# EAGLE design Stick1_jr1 (EAGLE 7.6.0)
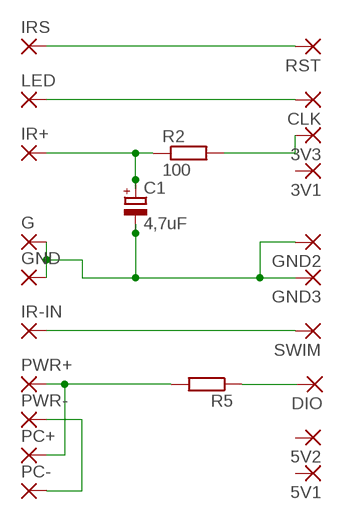
[diagram p0: schematic, sheet 1]

## Parts
3V1  SMD2  [SMD1,27-2,54]
3V3  SMD2  [SMD1,27-2,54]
5V1  SMD2  [SMD1,27-2,54]
5V2  SMD2  [SMD1,27-2,54]
C1  4,7uF  CPOL-EUE1.8-4  [E1,8-4]
CLK  SMD2  [SMD1,27-2,54]
DIO  SMD2  [SMD1,27-2,54]
G  SMD2  [SMD1,27-2,54]
GND  SMD2  [SMD1,27-2,54]
GND2  SMD2  [SMD1,27-2,54]
GND3  SMD2  [SMD1,27-2,54]
IR+  SMD2  [SMD1,27-2,54]
IR-IN  SMD2  [SMD1,27-2,54]
IRS  SMD2  [SMD1,27-2,54]
LED  SMD2  [SMD1,27-2,54]
PC+  SMD2  [SMD1,27-2,54]
PC-  SMD2  [SMD1,27-2,54]
PWR+  SMD2  [SMD1,27-2,54]
PWR-  SMD2  [SMD1,27-2,54]
R2  100  R-EU_0204/7  [0204/7]
R5  R-EU_0204/7  [0204/7]
RST  SMD2  [SMD1,27-2,54]
SWIM  SMD2  [SMD1,27-2,54]

## Nets
N$2 [Power]: 3V3.1(P) R2.2
N$3 [Power]: C1.+ IR+.1(P) R2.1
N$4: PC-.1(P) PWR-.1(P)
N$5: PC+.1(P) PWR+.1(P) R5.2
N$6: DIO.1(P) R5.1
N$7: CLK.1(P) LED.1(P)
N$8: IRS.1(P) RST.1(P)
N$9: IR-IN.1(P) SWIM.1(P)
N$11 [Power]: C1.- G.1(P) GND2.1(P) GND3.1(P) GND.1(P)
Unconnected: 3V1.1(P) 5V1.1(P) 5V2.1(P)

## Library data of the parts
3V1 3V3 5V1 5V2 CLK DIO G GND GND2 GND3 IR+ IR-IN IRS LED PC+ PC- PWR+ PWR- RST SWIM = wirepad:SMD2: SMD PAD
C1 = rcl:CPOL-EU: POLARIZED CAPACITOR, European symbol
R2 R5 = rcl:R-EU_: RESISTOR, European symbol

## Net classes
0 default: width 0.406 mm
1 Power: width 0.61 mm

## Board
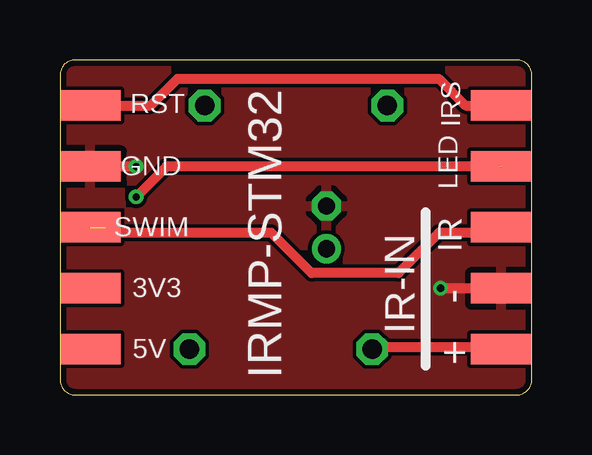
[diagram p1: board, top side]
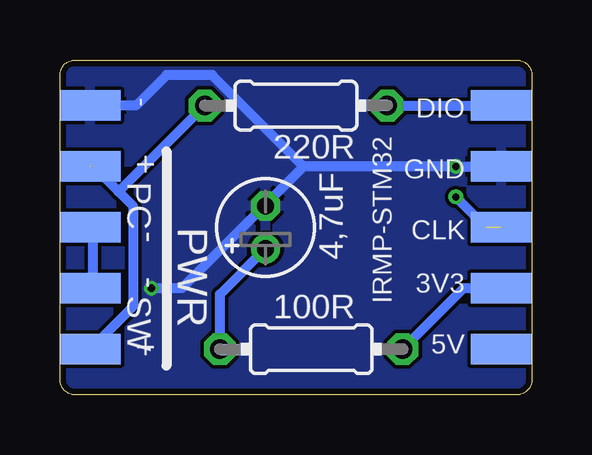
[diagram p2: board, bottom side, seen from below]

Size 19.68 x 13.97 mm. Coordinates in mm from the lower left corner, seen from the top.
Outline: 0,13.34 0,0.64 arc90 0.63,0 19.05,0 arc90 19.68,0.64 19.68,13.34 arc90 19.05,13.97 0.63,13.97 arc90 0,13.34
Copper layers (1*16): Top 0.035mm / dielectric 1.5mm / Bottom 0.035mm
Design rules "Fusion_eagle_rule_v1.1": minimum track width 6mil, minimum drill 12mil, track to track 6mil, track to pad 6mil, pad to pad 6mil, via to via 6mil, smd to smd 0mil, copper to edge 10mil, drill to drill 10mil, minimum pad ring 10mil, minimum via ring 6mil, stop-mask expansion 2mil, vias tented up to drill 100mil, thermal gap 10mil

### Footprints (pad centres in the part's own frame; a part is rotated, then mirrored left to right if it is on the bottom)
SMD1,27-2,54 = smd 1.27 x 2.54: 1 0,0
E1,8-4 = drill 0.711 pad 1.168: + -0.889,0 | drill 0.711 pad 1.168 octagon: - 0.889,0
0204/7 = drill 0.813 octagon: 1 -3.81,0; 2 3.81,0

### Placement (x,y rotation side)
3V1  1.27,4.44 90 top
3V3  1.27,4.44 90 bottom
5V1  1.27,1.91 90 bottom
5V2  1.27,1.91 90 top
C1  11.11,6.99 90 bottom
CLK  1.27,6.99 90 bottom
DIO  1.27,12.07 90 bottom
G  18.41,12.07 270 bottom
GND  18.41,4.44 90 top
GND2  1.27,9.53 90 top
GND3  1.27,9.53 90 bottom
IR+  18.41,1.91 90 top
IR-IN  18.41,6.99 90 top
IRS  18.41,12.07 270 top
LED  18.41,9.53 270 top
PC+  18.41,9.53 90 bottom
PC-  18.41,6.99 90 bottom
PWR+  18.41,1.91 90 bottom
PWR-  18.41,4.44 90 bottom
R2  9.21,1.91 0 bottom
R5  9.84,12.07 180 bottom
RST  1.27,12.07 90 top
SWIM  1.27,6.99 90 top

### Tracks (layer width: path | path; a pad name or v marks a point on that pad's centre or on a via)
GND2
  pour Bottom: 0.63,13.97 19.05,13.97 arc-90 19.68,13.34 19.68,0.64 arc-90 19.05,0 0.63,0 arc-90 0,0.64 0,13.34 arc-90
N$2
  Bottom 0.406: 3V3.1 2.86,4.44 R2.2
N$3
  Top 0.406: IR+.1 18.31,2.01 13.28,2.01 R2.1
  Bottom 0.406: R2.1 13.02,4.19 C1.+
N$4
  Bottom 0.406: PWR-.1 18.31,4.52 18.31,6.76 PC-.1
N$5  (1 unrouted)
  Bottom 0.406: PWR+.1 16.64,3.68 16.64,7.87 17.24,8.48 | 18.31,9.55 17.24,8.48 | R5.2 17.24,8.48
N$6
  Bottom 0.406: R5.1 DIO.1
N$7  (via drill 0.3)  (1 unrouted)
  Top 0.406: LED.1 4.45,9.53 v3.18,8.26
  Bottom 0.406: v3.18,8.26 1.91,6.99
N$8
  Top 0.406: RST.1 3.79,12.07 4.9,13.18 15.8,13.18 16.92,12.07 IRS.1
N$9
  Top 0.406: SWIM.1 2.01,6.76 8.81,6.76 10.49,5.08 14.12,5.08 15.8,6.76 18.31,6.76 IR-IN.1
N$11  (via drill 0.3)
  Top 0.406: v3.18,9.53 GND2.1 | GND.1 v15.88,4.44
  Bottom 0.406: 2.54,9.53 v3.18,9.53 9.53,9.53 | 9.53,9.53 10.8,8.26 C1.- 11.43,7.62 14.61,4.44 v15.88,4.44 | G.1 16.51,12.07 15.24,13.34 13.34,13.34 9.53,9.53
  pour Top: 0.63,13.97 19.05,13.97 arc-90 19.68,13.34 19.68,0.64 arc-90 19.05,0 0.63,0 arc-90 0,0.64 0,13.34 arc-90
  pour Bottom: 0.63,13.97 19.05,13.97 arc-90 19.68,13.34 19.68,0.64 arc-90 19.05,0 0.63,0 arc-90 0,0.64 0,13.34 arc-90

### Text on the board
tNames: RST | IRS | GND | LED | SWIM | IR | 3V3 | - | 5V | IR-IN | IRMP-STM32 | +
bNames: DIO | - | IRMP-STM32 | GND | 220R | 4,7uF | + | PC | CLK | PWR | - | 3V3 | - | SW | 100R | 5V | +